# EAGLE design EnconderPCB (EAGLE 6.6.0)
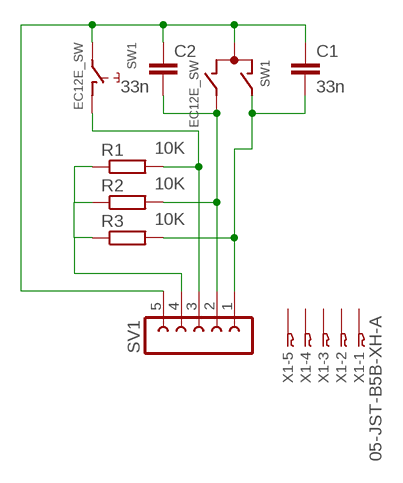
[diagram p0: schematic, sheet 1]

## Parts
C1  33n  C-EUC0603  [C0603]
C2  33n  C-EUC0603  [C0603]
R1  10K  R-EU_R0603  [R0603]
R2  10K  R-EU_R0603  [R0603]
R3  10K  R-EU_R0603  [R0603]
SV1  FE05-1  [FE05-1]
SW1  EC12E_SW  [ALPS_EC12E_SW]
X1  05-JST-B5B-XH-A  [B5B-XH]

## Nets
N$1: C1.2 R3.2 SV1.1 SW1.A
N$2: C2.2 R2.2 SV1.2 SW1.B
N$3: R1.2 SV1.3 SW1.D
N$4: C1.1 C2.1 SV1.5 SW1.C SW1.E
N$5: R1.1 R2.1 R3.1 SV1.4
Unconnected: SW1.GND1(G) SW1.GND2(G) X1.P$1 X1.P$2 X1.P$3 X1.P$4 X1.P$5

## Library data of the parts
C1 C2 = rcl:C-EU: CAPACITOR, European symbol
R1-R3 = rcl:R-EU_: RESISTOR, European symbol
SV1 = con-lsta:FE05-1: FEMALE HEADER; OC_FARNELL: unknown; OC_NEWARK: unknown
SW1 = switch-alps:EC12E_SW: ALPS rotary Encoder EC12E series with switch; MPN: EC12E2424407; OC_FARNELL: 1520813; OC_NEWARK: 74M1068
X1 = bt_con-jst-xh:05-JST: JST CONNECTOR

## Board
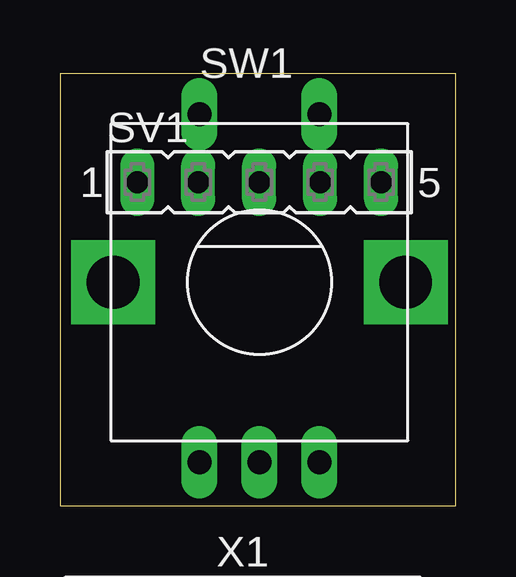
[diagram p1: board, top side]
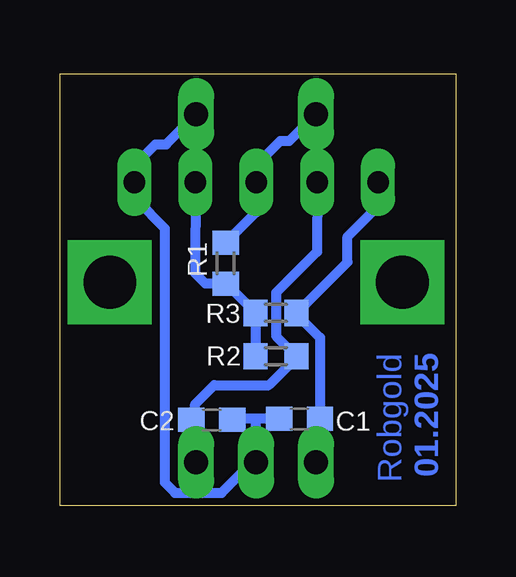
[diagram p2: board, bottom side, seen from below]

Size 16.5 x 18 mm. Coordinates in mm from the lower left corner, seen from the top.
Outline: 0,0 16.5,0 16.5,18 0,18 0,0
Copper layers (1*16): Top 0.035mm / dielectric 1.5mm / Bottom 0.035mm
Design rules "default": minimum track width 10mil, minimum drill 24mil, track to track 8mil, track to pad 8mil, pad to pad 8mil, via to via 8mil, smd to smd 8mil, copper to edge 40mil, drill to drill 8mil, minimum pad ring 10mil, minimum via ring 8mil, stop-mask expansion 4mil, vias tented up to drill 0mil, thermal gap 10mil

### Footprints (pad centres in the part's own frame; a part is rotated, then mirrored left to right if it is on the bottom)
C0603 = smd 1.1 x 1: 1 -0.85,0; 2 0.85,0
R0603 = smd 1 x 1.1: 1 -0.85,0; 2 0.85,0
FE05-1 = drill 0.9 long: 1 -5.08,0; 2 -2.54,0; 3 0,0; 4 2.54,0; 5 5.08,0
ALPS_EC12E_SW = drill 1 long: A -2.5,-7.5; B 2.5,-7.5; C 0,-7.5; D -2.5,7; E 2.5,7 | drill 2.2 pad 3.5 square: GND1 -6.1,0; GND2 6.1,0
B5B-XH = drill 1 square: P$1 5,0 | drill 1: P$2 2.5,0; P$3 0,0; P$4 -2.5,0; P$5 -5,0

### Placement (x,y rotation side)
C1  6.5,3.62 0 bottom
C2  10.16,3.58 180 bottom
R1  9.59,10.12 90 bottom
R2  7.49,6.24 0 bottom
R3  7.49,8.04 0 bottom
SV1  8.31,13.49 0 top
SW1  8.32,9.32 0 top
X1  7.62,-6.35 0 top  (outside the outline)

### Tracks (layer width: path | path; a pad name or v marks a point on that pad's centre or on a via)
N$1
  Bottom 0.406: SV1.1 3.24,12.49 4.51,11.22 4.51,10.16 6.62,8.04 R3.2 6.63,8 5.66,7.01 C1.2 5.67,1.97 SW1.A
N$2
  Bottom 0.406: SW1.B 10.82,3.58 C2.2 10.86,3.58 10.86,4.24 10.07,5.03 7.79,5.03 6.64,6.18 R2.2 7.48,7.08 7.48,8.89 5.78,10.59 SV1.2
N$3
  Bottom 0.406: R1.2 8.32,12.23 SV1.3 8.31,14.21 7.31,15.21 6.93,15.21 SW1.D
N$4
  Bottom 0.406: 13.4,12.71 SV1.5 13.39,14.2 12.52,15.07 12.07,15.07 SW1.E | 13.4,12.71 13.4,12.49 | C1.1 8.32,3.62 | 8.32,3.62 9.28,3.62 C2.1 | 8.32,3.62 SW1.C 8.49,1.82 9.76,0.55 11.7,0.55 12.13,0.98 12.13,11.57 13.27,12.71 13.4,12.71
N$5
  Bottom 0.406: SV1.4 10.86,9.69 10.44,9.27 R1.1 9.55,9.27 R3.1 R2.1

### Text on the board
Bottom: 01.2025 | Robgold